# Altium schematic sheet Main.SchDoc
size A4
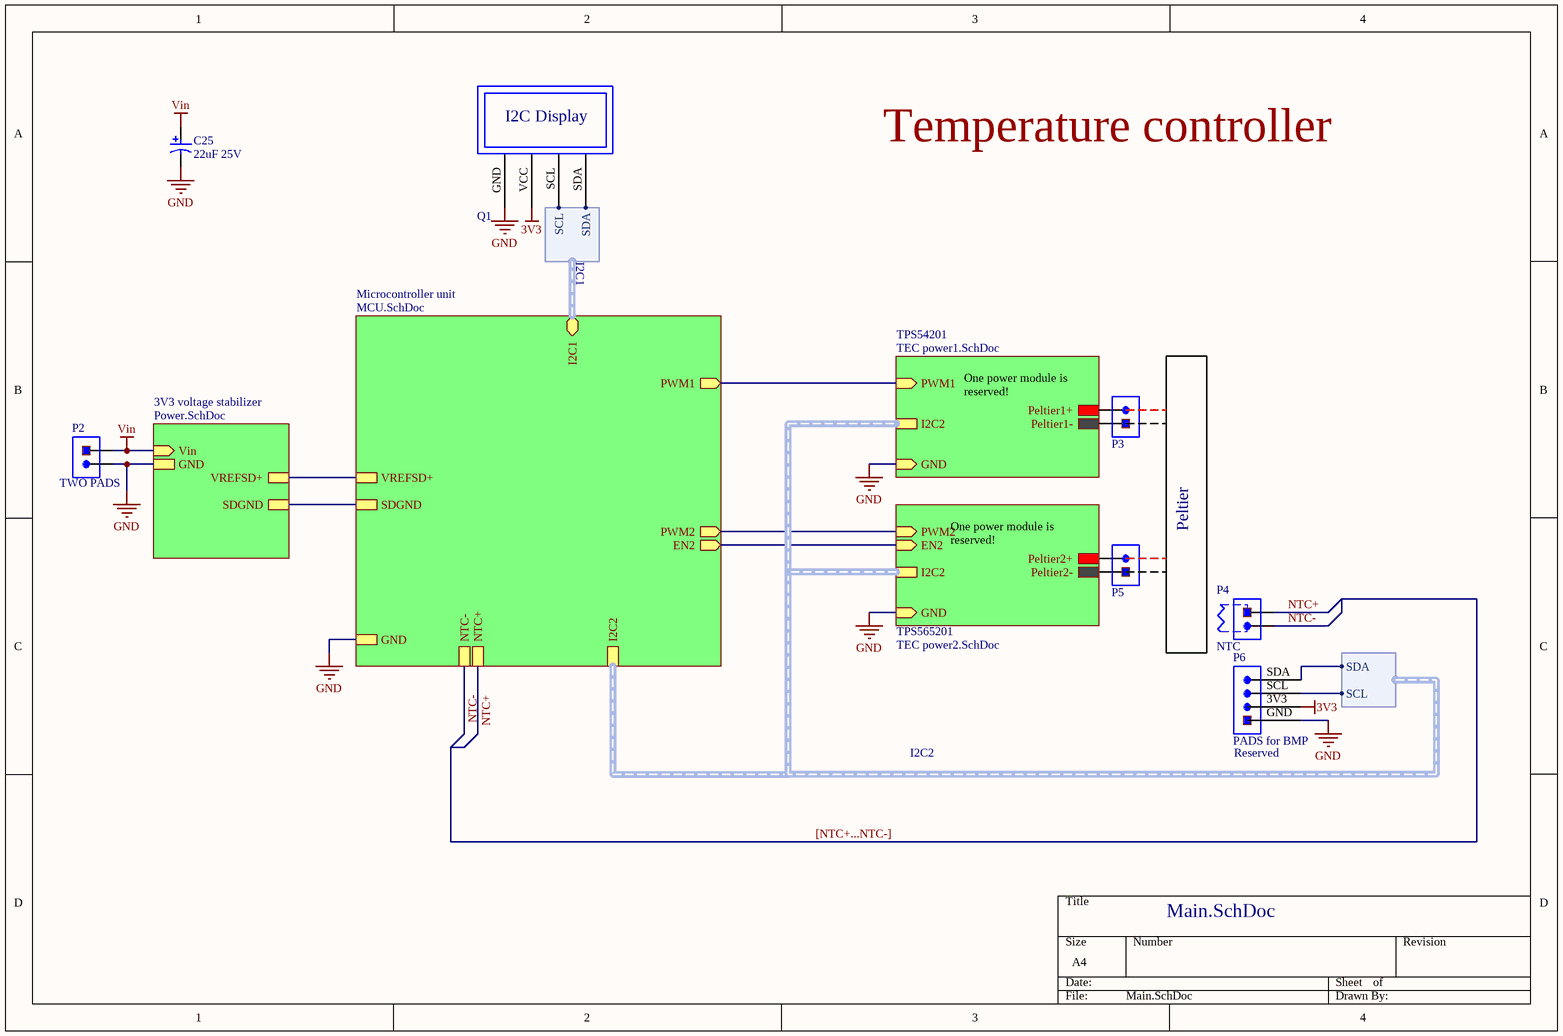
[diagram p0: Main.SchDoc]

## Parts
C25  22uF 25V  [PNSC-FP-V-C_V]
P2  TWO PADS  [TWO PADS - medium]
P3  TWO PADS for TEC  [TWO PADS]  (value not drawn)
P4  NTC  [TWO PADS]
P5  TWO PADS for TEC  [TWO PADS]  (value not drawn)
P6  PADS for BMP  [FOUR PADS]
Q1  SSD1306 OLED_big  [SSD1306 OLED]  (value not drawn)

## Sub-sheets
3V3 voltage stabilizer = Power.SchDoc: Vin (in), VREFSD+, SDGND, GND
Microcontroller unit = MCU.SchDoc: I2C1 (bidir, harness I2C1), PWM1 (out), NTC+, NTC-, SDGND, VREFSD+, GND, I2C2 (harness I2C2), PWM2 (out), EN2 (out)
TPS54201 = TEC power1.SchDoc: PWM1 (in), Peltier1+, Peltier1-, GND (in), I2C2 (harness I2C2)
TPS565201 = TEC power2.SchDoc: PWM2 (in), EN2 (in), Peltier2+, Peltier2-, GND (in), I2C2 (harness I2C2)

## Harnesses
I2C1: SCL, SDA
I2C2: SDA, SCL

## Nets
3V3: P6.3V3 Q1.VCC
GND: C25.2 P2.1 P6.GND Q1.GND ; sheet 3V3 voltage stabilizer/GND, sheet Microcontroller unit/GND, sheet TPS54201/GND, sheet TPS565201/GND
Vin: C25.1 P2.2 ; sheet 3V3 voltage stabilizer/Vin
NTC+: P4.2 ; sheet Microcontroller unit/NTC+
NTC-: P4.1 ; sheet Microcontroller unit/NTC-
NetP3_1: P3.1 ; sheet TPS54201/Peltier1+
NetP3_2: P3.2 ; sheet TPS54201/Peltier1-
NetP5_1: P5.1 ; sheet TPS565201/Peltier2+
NetP5_2: P5.2 ; sheet TPS565201/Peltier2-
NetP6_SCL: P6.SCL ; sheet Microcontroller unit/I2C2.SCL
NetP6_SDA: P6.SDA ; sheet Microcontroller unit/I2C2.SDA
NetQ1_SCL: Q1.SCL ; sheet Microcontroller unit/I2C1.SCL
NetQ1_SDA: Q1.SDA ; sheet Microcontroller unit/I2C1.SDA
(unnamed): sheet 3V3 voltage stabilizer/VREFSD+, sheet Microcontroller unit/VREFSD+
(unnamed): sheet 3V3 voltage stabilizer/SDGND, sheet Microcontroller unit/SDGND
(unnamed): sheet Microcontroller unit/PWM1, sheet TPS54201/PWM1
(unnamed): sheet Microcontroller unit/PWM2, sheet TPS565201/PWM2
(unnamed): sheet Microcontroller unit/EN2, sheet TPS565201/EN2

## Buses and harness runs
bus [NTC+...NTC-]
harness sheet Microcontroller unit/I2C2 = sheet TPS54201/I2C2 = sheet TPS565201/I2C2

## Notes on the sheet
- Temperature controller
- One power module is reserved!
- Peltier
- (near P6) Reserved
- (in symbol SSD1306 OLED_big) I2C Display

## Library data of the parts
C25 = CMP-2000-06213-1: Aluminum Electrolytic Capacitor, 22 uF, +/- 20%, 25 V, 2-Pin SMD (Size Code C), -55 to 105 degC, RoHS, Tape and Reel; Manufacturer: Panasonic; ESR (Equivalent Series Resistance): 0.36O; Ripple Current: 240mA; Capacitance: 22µF; Lifetime@Temperature: 2000Hrs@105°C; Type: Can; Package Reference: FP-V-C; Package Description: 2-Pin Electrolytic Aluminum Capacitor, Body 5.3 x 5.3 mm; Operating Temp Range: -55to+105°C; Mounting Technology: SurfaceMount; Datasheet URL: http://industrial.panasonic.com/cdbs/www-data/pdf/RDE0000/ABA0000C1184.pdf; Case Size/Dimension: Ø5x5.8mm; Operating Temp-Max: 105°C; Package URL: http://industrial.panasonic.com/cdbs/www-data/pdf/RDE0000/DME0000COL48.pdf; Rated Voltage: 25V; Datasheet Version: 03/2016; Series: FP; Manufacturer URL: http://www.panasonic.com/; Value: 22uF; Voltage: 25V; LCSC Part #: C249771
P2 = TWO PADS: Value: 1uF
P3 P5 = TWO PADS for TEC: Value: 1uF
P4 = TWO PADS for NTC: Value: 1uF
P6 = PADS for BMP: Value: 1uF
Q1 = SSD1306 OLED_big: I2C display